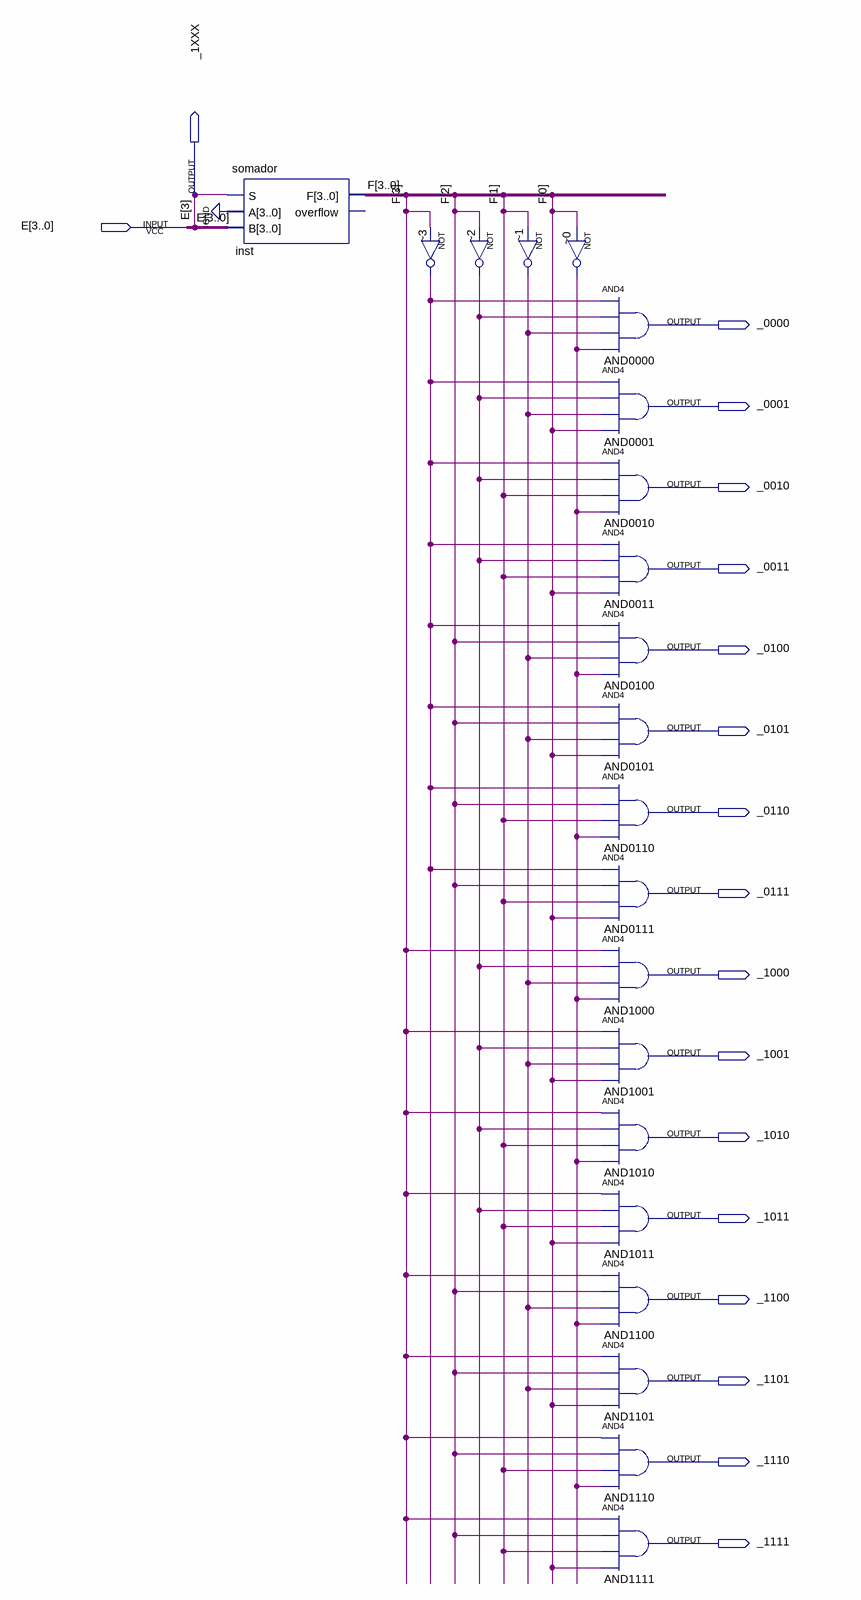
[diagram p0: schematic sheet]
// Quartus schematic b2d.bdf as structural Verilog: 21 symbols, 18 pins
module b2d (
  input  [3:0] E,
  output _1XXX,
  output _0000,
  output _0001,
  output _0010,
  output _0011,
  output _0100,
  output _0101,
  output _0110,
  output _0111,
  output _1000,
  output _1001,
  output _1010,
  output _1011,
  output _1100,
  output _1101,
  output _1110,
  output _1111
);

  wire _0_out, _1_out, _2_out, _3_out;
  wire [3:0] F;

  somador inst (.S(E[3]), .A(4'b0000), .B(E), .F(F));  // open: overflow
  not \u_~3  (_3_out, F[3]);
  not \u_~2  (_2_out, F[2]);
  not \u_~1  (_1_out, F[1]);
  not \u_~0  (_0_out, F[0]);
  and AND0000 (_0000, _3_out, _2_out, _1_out, _0_out);
  and AND0001 (_0001, _3_out, _2_out, _1_out, F[0]);
  and AND0010 (_0010, _3_out, _2_out, F[1], _0_out);
  and AND0011 (_0011, _3_out, _2_out, F[1], F[0]);
  and AND0100 (_0100, _3_out, F[2], _1_out, _0_out);
  and AND0101 (_0101, _3_out, F[2], _1_out, F[0]);
  and AND0110 (_0110, _3_out, F[2], F[1], _0_out);
  and AND0111 (_0111, _3_out, F[2], F[1], F[0]);
  and AND1000 (_1000, F[3], _2_out, _1_out, _0_out);
  and AND1001 (_1001, F[3], _2_out, _1_out, F[0]);
  and AND1010 (_1010, F[3], _2_out, F[1], _0_out);
  and AND1011 (_1011, F[3], _2_out, F[1], F[0]);
  and AND1100 (_1100, F[3], F[2], _1_out, _0_out);
  and AND1101 (_1101, F[3], F[2], _1_out, F[0]);
  and AND1110 (_1110, F[3], F[2], F[1], _0_out);
  and AND1111 (_1111, F[3], F[2], F[1], F[0]);

  assign _1XXX = E[3];
endmodule
